# Altium schematic sheet OutputConnectors.SchDoc
size Tabloid; DocumentNumber: 8; SheetNumber: 8; SheetTotal: 11; SheetName: Audio output connectors
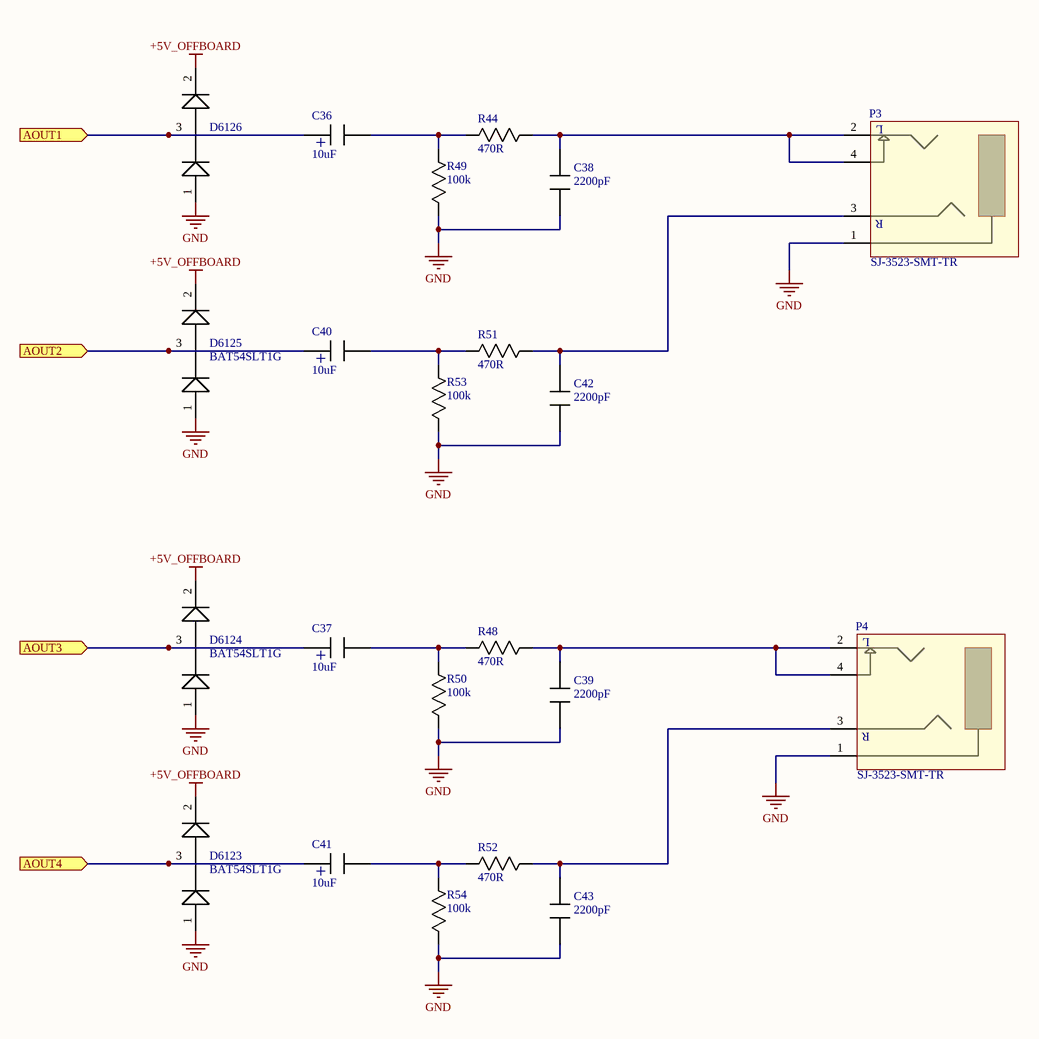
[diagram p0: OutputConnectors.SchDoc]

## Parts
C36  value 10uF  [CAP_RAD_SMD_DIA157]  (hidden comment: Capacitor_Polarized)
C37  value 10uF  [CAP_RAD_SMD_DIA157]  (hidden comment: Capacitor_Polarized)
C38  value 2200pF  [0603]  (hidden comment: Capacitor)
C39  value 2200pF  [0603]  (hidden comment: Capacitor)
C40  value 10uF  [CAP_RAD_SMD_DIA157]  (hidden comment: Capacitor_Polarized)
C41  value 10uF  [CAP_RAD_SMD_DIA157]  (hidden comment: Capacitor_Polarized)
C42  value 2200pF  [0603]  (hidden comment: Capacitor)
C43  value 2200pF  [0603]  (hidden comment: Capacitor)
D6123  Mfg_PN: BAT54SLT1G  [SOT23_132]  (hidden comment: Diode_dual)
D6124  Mfg_PN: BAT54SLT1G  [SOT23_132]  (hidden comment: Diode_dual)
D6125  Mfg_PN: BAT54SLT1G  [SOT23_132]  (hidden comment: Diode_dual)
D6126  Diode_dual  [SOT23_132]  (value not drawn)
P3  Mfg_PN: SJ-3523-SMT-TR  [CONN_3.5mm_CUI 3523-SMT]  (hidden comment: CON_AUDIO_3.5mm_TRS_ALT1)
P4  Mfg_PN: SJ-3523-SMT-TR  [CONN_3.5mm_CUI 3523-SMT]  (hidden comment: CON_AUDIO_3.5mm_TRS_ALT1)
R44  value 470R  [0603]  (hidden comment: Resistor)
R48  value 470R  [0603]  (hidden comment: Resistor)
R49  value 100k  [0603]  (hidden comment: Resistor)
R50  value 100k  [0603]  (hidden comment: Resistor)
R51  value 470R  [0603]  (hidden comment: Resistor)
R52  value 470R  [0603]  (hidden comment: Resistor)
R53  value 100k  [0603]  (hidden comment: Resistor)
R54  value 100k  [0603]  (hidden comment: Resistor)

## Ports
AOUT1 (in), AOUT2 (in), AOUT3 (in), AOUT4 (in)

## Nets
+5V_OFFBOARD: D6123.2(K) D6124.2(K) D6125.2(K) D6126.2(K)
GND: C38.2 C39.2 C42.2 C43.2 D6123.1(K) D6124.1(K) D6125.1(K) D6126.1(K) P3.1 P4.1 R49.1 R50.1 R53.1 R54.1
AOUT1: C36.+ D6126.3(AK) ; port AOUT1
AOUT2: C40.+ D6125.3(AK) ; port AOUT2
AOUT3: C37.+ D6124.3(AK) ; port AOUT3
AOUT4: C41.+ D6123.3(AK) ; port AOUT4
NetC36_-: C36.- R44.1 R49.2
NetC37_-: C37.- R48.1 R50.2
NetC38_1: C38.1 P3.2(L) P3.4(NC_L) R44.2
NetC39_1: C39.1 P4.2(L) P4.4(NC_L) R48.2
NetC40_-: C40.- R51.1 R53.2
NetC41_-: C41.- R52.1 R54.2
NetC42_1: C42.1 P3.3(R) R51.2
NetC43_1: C43.1 P4.3(R) R52.2

## Notes on the sheet
- Sheet name
- http://creativecommons.org
- Project name
- Contact
- Rev
- Date
- Sheet
- of

## Library data of the parts
C36 C37 C40 C41 = Capacitor_Polarized: Capacitor; Mfg: Nichicon; Mfg_PN: UWX1C100MCL1GB; HelpURL: *; NI: *; Supplier1: Digikey; Supplier1_PN: 493-2100-1-ND; Tolerance: *; Type: *; Rating: *
C38 C39 C42 C43 = Capacitor: Mfg: Murata; Mfg_PN: GRM1885C1H222JA01D; HelpURL: *; NI: *; Supplier1: Digikey; Supplier1_PN: 490-1459-1-ND; Tolerance: *; Type: *; Rating: *
D6123-D6125 = Diode_dual: Diode; Mfg: Onsemi; HelpURL: *; NI: *; Supplier1: Digikey; Supplier1_PN: BAT54SLT1GOSCT-ND; Tolerance: *; Type: *; Rating: *; Value: *
D6126 = Diode_dual: Diode; Mfg: Onsemi; Mfg_PN: BAT54SLT1G; HelpURL: *; NI: *; Supplier1: Digikey; Supplier1_PN: BAT54SLT1GOSCT-ND; Tolerance: *; Type: *; Rating: *; Value: *
P3 P4 = CON_AUDIO_3.5mm_TRS_ALT1: Audio 3.5mm CUI SJ-3523-SMT-TR; HelpURL: *; Mfg: CUI; NI: *; Rating: *; Supplier1: Digikey; Supplier1_PN: CP-3523SJCT-ND; Tolerance: *; Type: *; Value: *
R44 R48 R51 R52 = Resistor: Mfg: Yageo; Mfg_PN: RC0603JR-07470RL; HelpURL: *; NI: *; Supplier1: Digikey; Supplier1_PN: 311-470GRCT-ND; Type: *; Rating: *; Tolerance: *
R49 R50 R53 R54 = Resistor: Mfg: Yageo; Mfg_PN: 311-10GRCT-ND; HelpURL: *; NI: *; Supplier1: Digikey; Supplier1_PN: 311-100KGRCT-ND; Type: *; Rating: *; Tolerance: *